# Altium schematic sheet BMP388.SchDoc
size A
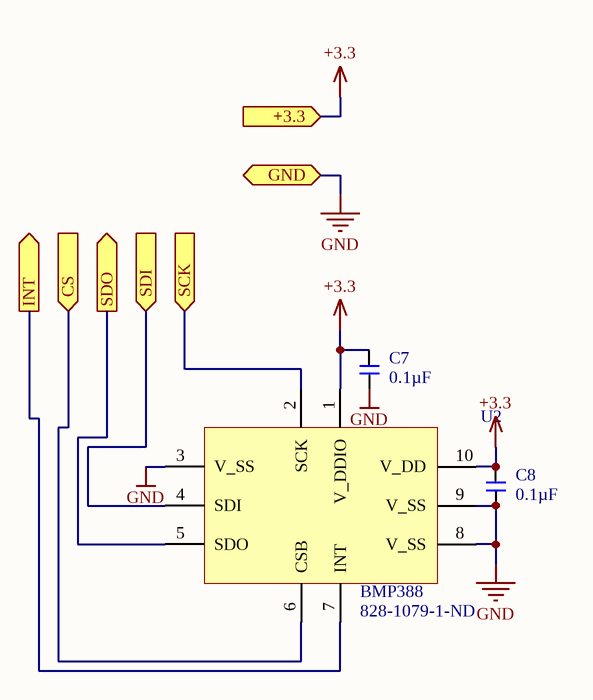
[diagram p0: BMP388.SchDoc]

## Parts
C7  Capacitance (shorthand): 0.1µF  [C0603]  (hidden comment: __template_cap)
C8  Capacitance (shorthand): 0.1µF  [C0603]  (hidden comment: __template_cap)
U2  BMP388  Supplier Part Number 1: 828-1079-1-ND  [8 pin LGA]

## Ports
+3.3 (in), CS (in), GND (bidir), INT (out), SCK (in), SDI (in), SDO (out)

## Nets
+3.3: C7.2 C8.2 U2.1(V_DDIO) U2.10(V_DD) ; port +3.3
GND: C7.1 C8.1 U2.3(V_SS) U2.8(V_SS) U2.9(V_SS) ; port GND
CS: U2.6(CSB) ; port CS
INT: U2.7(INT) ; port INT
SCK: U2.2(SCK) ; port SCK
SDI: U2.4(SDI) ; port SDI
SDO: U2.5(SDO) ; port SDO

## Library data of the parts
C7 C8 = CAP CER 0603 0.1µF X7R 50V 10%: Manufacturer: Murata Electronics North America; Capacitance - pF (Machine readable): 100000; type: capacitor; Dielectric: X7R; Supplier 1: Digikey; Supplier Part Number 1: 478-5052-1-ND; Supplier 2: Digi-Key; Supplier Part Number 2: 490-8020-1-ND
U2 = BMP388: Pressure Sensor 4.35 PSI ~ 18.13 PSI (30 kPa ~ 125 kPa) Absolute 10-WFLGA; Manufacturer: Bosch Sensortec; Supplier 1: Digi-Key; Manufacturer Part Number: BMP388; Stock 1: 46050; Pricing 1: 1=3.93, 5=3.466, 10=3.061, 25=2.4832, 50=2.1946, 100=2.1368, 500=1.7903, 1000=1.6748, 5000=1.5593 (USD); ComponentLink1URL: https://ae-bst.resource.bosch.com/media/_tech/media/product_flyer/BST-BMP388-FL000-00.pdf; ComponentLink1Description: https://ae-bst.resource.bosch.com/media/_tech/media/product_flyer/BST-BMP388-FL000-00.pdf